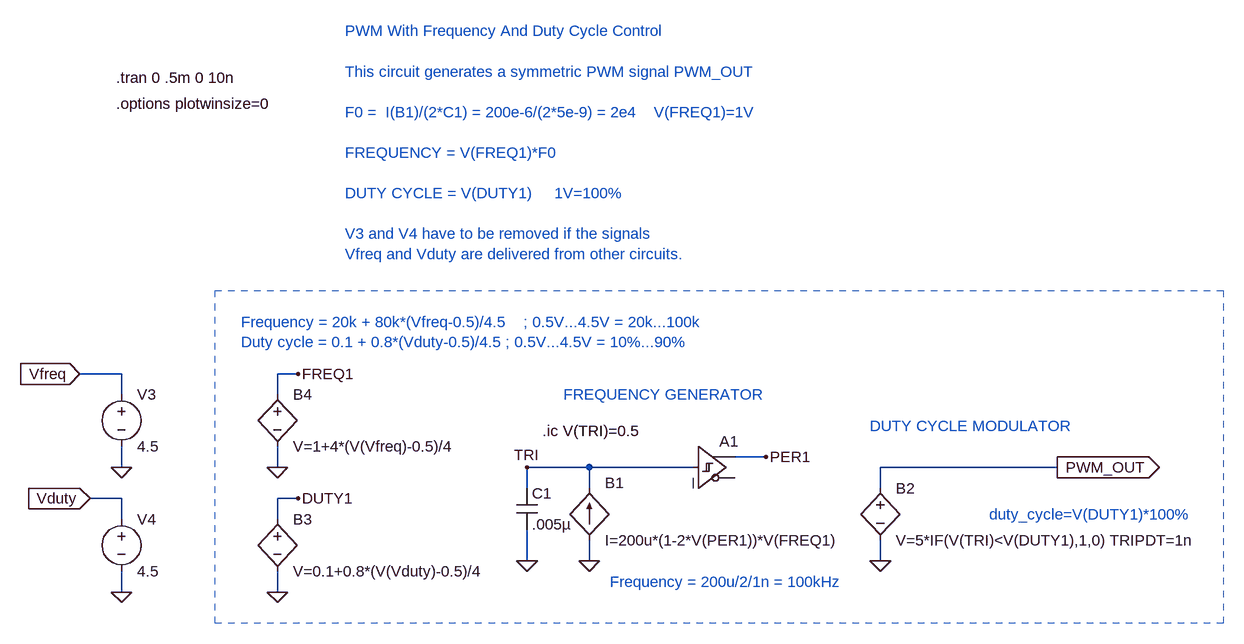
[diagram p0: schematic PWM_FREQ_DUTY1.asc]
PWM_FREQ_DUTY1.asc, the LTspice schematic file:
Version 4
SHEET 1 1844 740
WIRE -864 -224 -928 -224
WIRE -592 -224 -624 -224
WIRE -864 -192 -864 -224
WIRE -624 -192 -624 -224
WIRE 128 -96 80 -96
WIRE -864 -80 -864 -112
WIRE -624 -80 -624 -112
WIRE -144 -80 -240 -80
WIRE 16 -80 -144 -80
WIRE 576 -80 304 -80
WIRE -240 -48 -240 -80
WIRE -144 -48 -144 -80
WIRE 304 -48 304 -80
WIRE -864 -32 -912 -32
WIRE -592 -32 -624 -32
WIRE -864 0 -864 -32
WIRE -624 0 -624 -32
WIRE -240 64 -240 16
WIRE -144 64 -144 32
WIRE 304 64 304 32
WIRE -864 112 -864 80
WIRE -624 112 -624 80
FLAG -864 -80 0
FLAG -928 -224 Vfreq
IOPIN -928 -224 In
FLAG -144 64 0
FLAG -240 64 0
FLAG 128 -96 PER1
FLAG -240 -80 TRI
FLAG -864 112 0
FLAG -912 -32 Vduty
IOPIN -912 -32 In
FLAG 304 64 0
FLAG 576 -80 PWM_OUT
IOPIN 576 -80 Out
FLAG -624 -80 0
FLAG -624 112 0
FLAG -592 -224 FREQ1
FLAG -592 -32 DUTY1
SYMBOL voltage -864 -208 R0
WINDOW 123 0 0 Left 0
WINDOW 39 0 0 Left 0
SYMATTR InstName V3
SYMATTR Value 4.5
SYMBOL Digital\\schmitt 16 -144 R0
SYMATTR InstName A1
SYMATTR Value2 vt=0.5 vh=0.5 tripdt=1n trise=1n
SYMBOL cap -256 -48 R0
SYMATTR InstName C1
SYMATTR Value .005µ
SYMBOL bi -144 32 M180
WINDOW 0 24 88 Left 0
WINDOW 3 24 0 Left 0
SYMATTR InstName B1
SYMATTR Value I=200u*(1-2*V(PER1))*V(FREQ1)
SYMBOL voltage -864 -16 R0
WINDOW 123 0 0 Left 0
WINDOW 39 0 0 Left 0
SYMATTR InstName V4
SYMATTR Value 4.5
SYMBOL bv 304 -64 R0
SYMATTR InstName B2
SYMATTR Value V=5*IF(V(TRI)<V(DUTY1),1,0) TRIPDT=1n
SYMBOL bv -624 -16 R0
SYMATTR InstName B3
SYMATTR Value V=0.1+0.8*(V(Vduty)-0.5)/4
SYMBOL bv -624 -208 R0
SYMATTR InstName B4
SYMATTR Value V=1+4*(V(Vfreq)-0.5)/4
TEXT -872 -680 Left 0 !.tran 0 .5m 0 10n
TEXT -872 -640 Left 0 !.options plotwinsize=0
TEXT -520 -752 Left 0 ;PWM With Frequency And Duty Cycle Control\n \nThis circuit generates a symmetric PWM signal PWM_OUT\n \nF0 =  I(B1)/(2*C1) = 200e-6/(2*5e-9) = 2e4    V(FREQ1)=1V\n \nFREQUENCY = V(FREQ1)*F0\n \nDUTY CYCLE = V(DUTY1)     1V=100%\n \nV3 and V4 have to be removed if the signals\nVfreq and Vduty are delivered from other circuits.
TEXT -216 -136 Left 0 !.ic V(TRI)=0.5
TEXT 472 -8 Left 0 ;duty_cycle=V(DUTY1)*100%
TEXT 288 -144 Left 0 ;DUTY CYCLE MODULATOR
TEXT -184 -192 Left 0 ;FREQUENCY GENERATOR
TEXT -680 -304 Left 0 ;Frequency = 20k + 80k*(Vfreq-0.5)/4.5    ; 0.5V...4.5V = 20k...100k\nDuty cycle = 0.1 + 0.8*(Vduty-0.5)/4.5 ; 0.5V...4.5V = 10%...90%
TEXT -112 96 Left 0 ;Frequency = 200u/2/1n = 100kHz
RECTANGLE Normal 832 160 -720 -352 2

The netlist it stands for:
* PWM_FREQ_DUTY1.asc
V3 Vfreq 0 4.5
A1 TRI 0 0 0 0 0 PER1 0 SCHMITT vt=0.5 vh=0.5 tripdt=1n trise=1n
C1 TRI 0 .005µ
B1 0 TRI I=200u*(1-2*V(PER1))*V(FREQ1)
V4 Vduty 0 4.5
B2 PWM_OUT 0 V=5*IF(V(TRI)<V(DUTY1),1,0) TRIPDT=1n
B3 DUTY1 0 V=0.1+0.8*(V(Vduty)-0.5)/4
B4 FREQ1 0 V=1+4*(V(Vfreq)-0.5)/4
.tran 0 .5m 0 10n
.options plotwinsize=0
* PWM With Frequency And Duty Cycle Control
* This circuit generates a symmetric PWM signal PWM_OUT
* F0 =  I(B1)/(2*C1) = 200e-6/(2*5e-9) = 2e4    V(FREQ1)=1V
* FREQUENCY = V(FREQ1)*F0
* DUTY CYCLE = V(DUTY1)     1V=100%
* V3 and V4 have to be removed if the signals
* Vfreq and Vduty are delivered from other circuits.
.ic V(TRI)=0.5
* duty_cycle=V(DUTY1)*100%
* DUTY CYCLE MODULATOR
* FREQUENCY GENERATOR
* Frequency = 20k + 80k*(Vfreq-0.5)/4.5    ; 0.5V...4.5V = 20k...100k
* Duty cycle = 0.1 + 0.8*(Vduty-0.5)/4.5 ; 0.5V...4.5V = 10%...90%
* Frequency = 200u/2/1n = 100kHz
.backanno
.end